# EAGLE schematic Relay_Board_V3.6 (EAGLE 9.6.2)

## Sheet 1 of 2
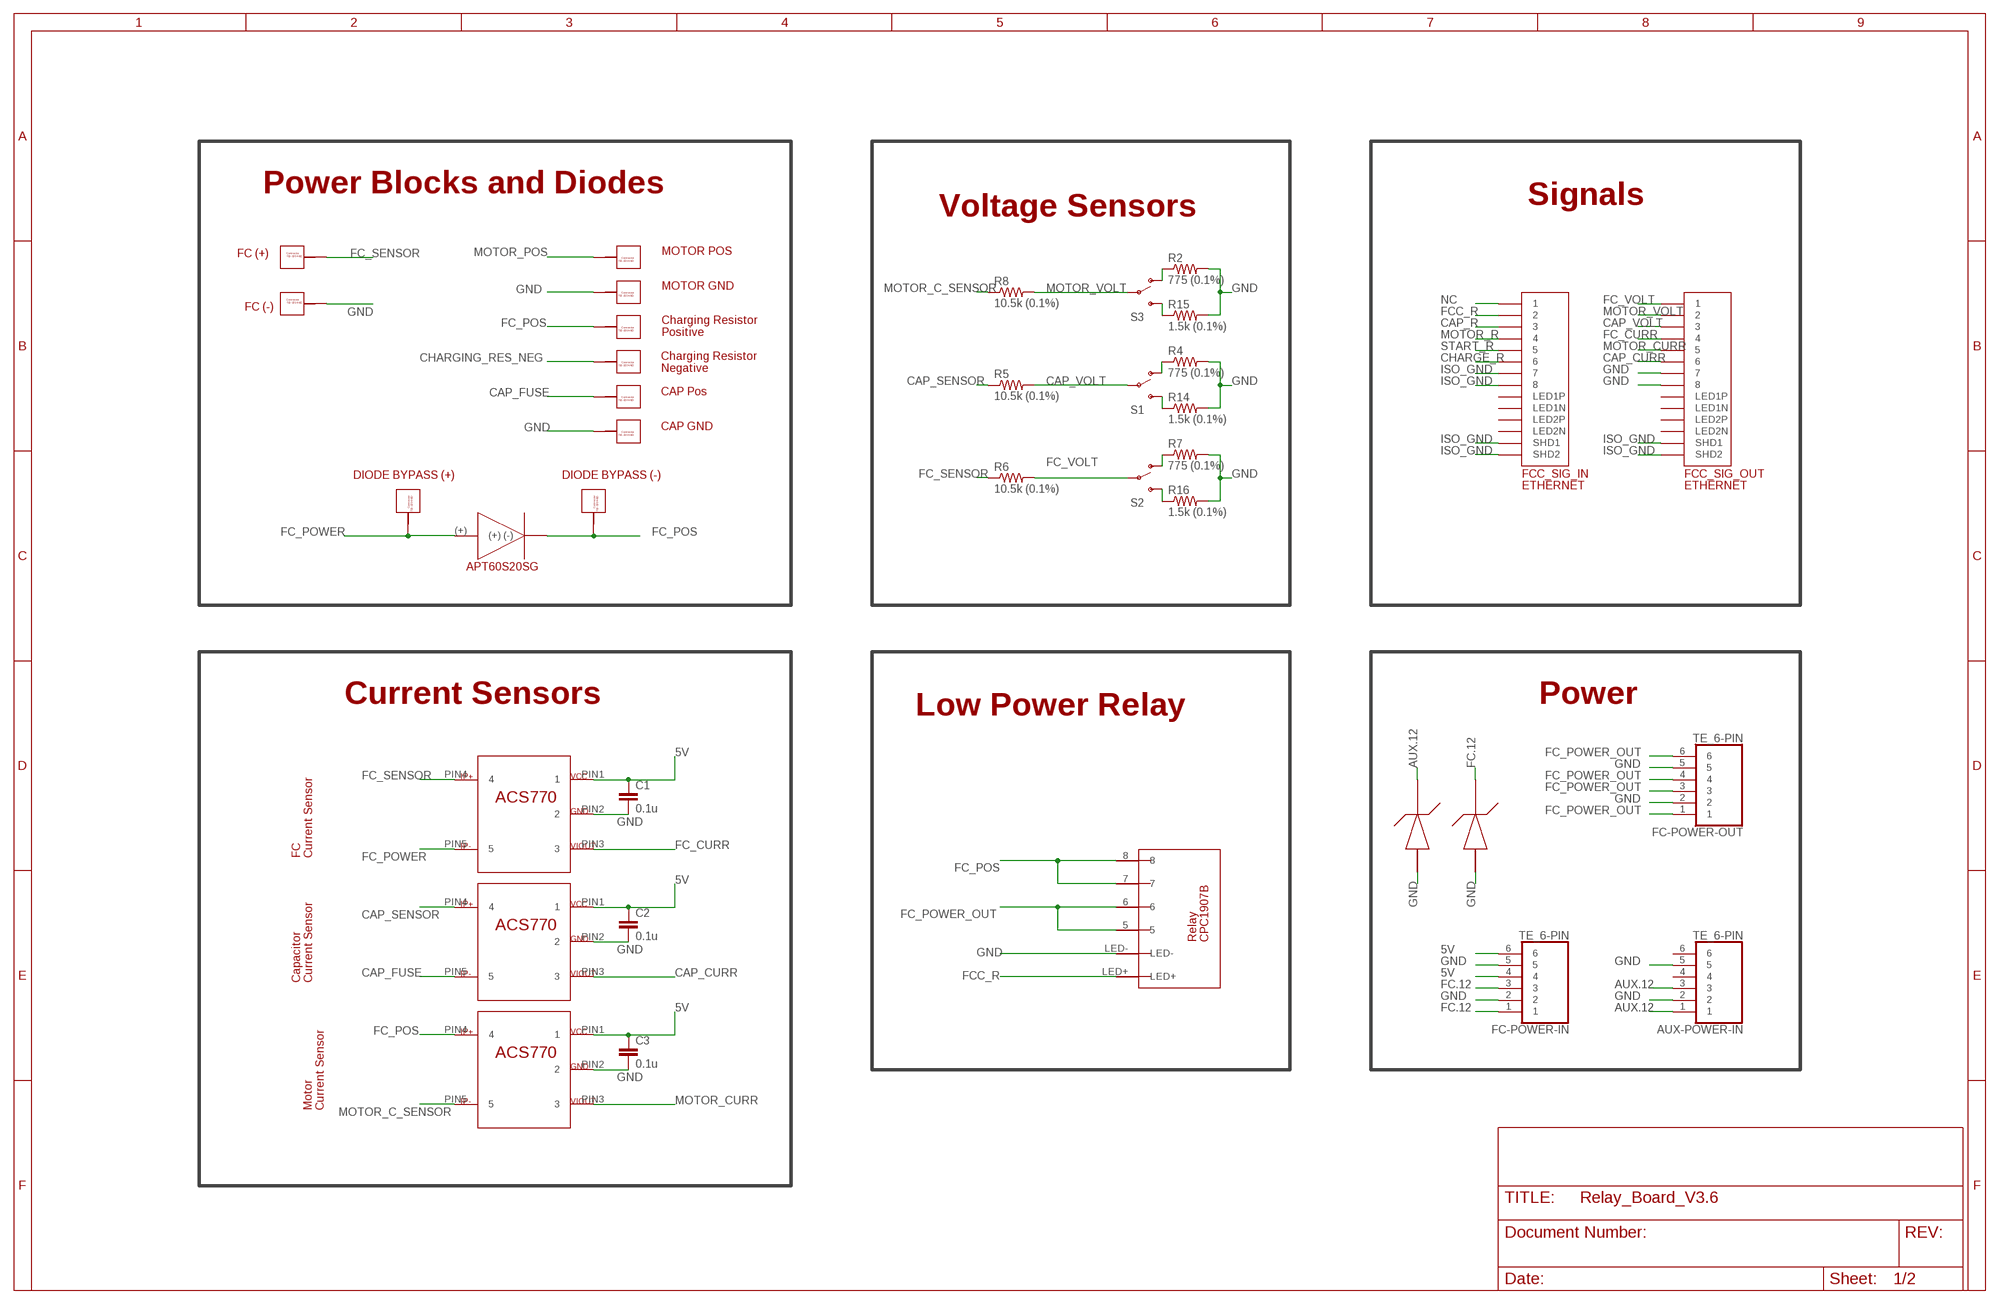
[diagram p0: schematic, sheet 1]

### Parts
AUX-POWER-IN  TE_6-PIN  [TE_6-PIN]
C1  0.1u  CAP0603-CAP  [0603-CAP]
C2  0.1u  CAP0603-CAP  [0603-CAP]
C3  0.1u  CAP0603-CAP  [0603-CAP]
CAP.GND  732-3204-ND_CONNECTOR  [732-3204-ND]
CAP.POS  732-3204-ND_CONNECTOR  [732-3204-ND]
CAP.POS1  732-3204-ND_CONNECTOR  [732-3204-ND]
CAP.POS2  732-3204-ND_CONNECTOR  [732-3204-ND]
D1  APT60S20SG  [TO268]
FC-POWER-IN  TE_6-PIN  [TE_6-PIN]
FC-POWER-OUT  TE_6-PIN  [TE_6-PIN]
FC.GND  732-3204-ND_CONNECTOR  [732-3204-ND]
FC.POS  732-3204-ND_CONNECTOR  [732-3204-ND]
FCC_SIG_IN  ETHERNET  [A122645-ND]
FCC_SIG_OUT  ETHERNET  [A122645-ND]
MOTOR.GROUND  732-3204-ND_CONNECTOR  [732-3204-ND]
MOTOR.POSITIVE  732-3204-ND_CONNECTOR  [732-3204-ND]
R2  775 (0.1%)  R-US_R0805  [R0805]
R4  775 (0.1%)  R-US_R0805  [R0805]
R5  10.5k (0.1%)  R-US_R0805  [R0805]
R6  10.5k (0.1%)  R-US_R0805  [R0805]
R7  775 (0.1%)  R-US_R0805  [R0805]
R8  10.5k (0.1%)  R-US_R0805  [R0805]
R14  1.5k (0.1%)  R-US_R0805  [R0805]
R15  1.5k (0.1%)  R-US_R0805  [R0805]
R16  1.5k (0.1%)  R-US_R0805  [R0805]
RES.NEG  732-3204-ND_CONNECTOR  [732-3204-ND]
RES.POS  732-3204-ND_CONNECTOR  [732-3204-ND]
S1  SWITCH-SPDTPTH  [SWITCH-SPDT]
S2  SWITCH-SPDTPTH  [SWITCH-SPDT]
S3  SWITCH-SPDTPTH  [SWITCH-SPDT]
U$7  ACS770LCB_CURRENTSENSOR  [ACS770LCB_CURRENTSENSOR]
U$8  ACS770LCB_CURRENTSENSOR  [ACS770LCB_CURRENTSENSOR]
U$9  ACS770LCB_CURRENTSENSOR  [ACS770LCB_CURRENTSENSOR]
U$15  P6KE15A-E3/54GICT-ND_TVS_DIODE  [P6KE15A-E3/54GICT-ND_TVS_DIODE]
U$16  P6KE15A-E3/54GICT-ND_TVS_DIODE  [P6KE15A-E3/54GICT-ND_TVS_DIODE]
U$22  RELAY-CPC1907B  [RELAY-CPC1907B]

### Nets
5V: C1.1 C2.1 C3.1 FC-POWER-IN.4 FC-POWER-IN.6 U$7.PIN1 U$8.PIN1 U$9.PIN1
AUX.12: AUX-POWER-IN.1 AUX-POWER-IN.3 U$16.P$2(P(-)) ; also sheet 2
CAP_CURR: FCC_SIG_OUT.P$6 U$8.PIN3
CAP_FUSE: CAP.POS.P$1 CAP.POS.P$2 CAP.POS.P$3 CAP.POS.P$4 CAP.POS.P$5 CAP.POS.P$6 CAP.POS.P$7 CAP.POS.P$8 CAP.POS.P$9 CAP.POS.P$10 U$8.PIN5
CAP_R: FCC_SIG_IN.P$3 ; also sheet 2
CAP_SENSOR: R5.1 U$8.PIN4 ; also sheet 2
CAP_VOLT: FCC_SIG_OUT.P$3 R5.2 S1.2(P)
CHARGE_R: FCC_SIG_IN.P$6 ; also sheet 2
CHARGING_RES_NEG: RES.NEG.P$1 RES.NEG.P$2 RES.NEG.P$3 RES.NEG.P$4 RES.NEG.P$5 RES.NEG.P$6 RES.NEG.P$7 RES.NEG.P$8 RES.NEG.P$9 RES.NEG.P$10 ; also sheet 2
FC.12: FC-POWER-IN.1 FC-POWER-IN.3 U$15.P$2(P(-)) ; also sheet 2
FC_CURR: FCC_SIG_OUT.P$4 U$7.PIN3
FC_POS: CAP.POS2.P$1 CAP.POS2.P$2 CAP.POS2.P$3 CAP.POS2.P$4 CAP.POS2.P$5 CAP.POS2.P$6 CAP.POS2.P$7 CAP.POS2.P$8 CAP.POS2.P$9 CAP.POS2.P$10 D1.(-) D1.C@1((-)) D1.C@2((-)) RES.POS.P$1 RES.POS.P$2 RES.POS.P$3 RES.POS.P$4 RES.POS.P$5 RES.POS.P$6 RES.POS.P$7 RES.POS.P$8 RES.POS.P$9 RES.POS.P$10 U$9.PIN4 U$22.7 U$22.8 ; also sheet 2
FC_POWER: CAP.POS1.P$1 CAP.POS1.P$2 CAP.POS1.P$3 CAP.POS1.P$4 CAP.POS1.P$5 CAP.POS1.P$6 CAP.POS1.P$7 CAP.POS1.P$8 CAP.POS1.P$9 CAP.POS1.P$10 D1.(+) U$7.PIN5
FC_POWER_OUT: FC-POWER-OUT.1 FC-POWER-OUT.3 FC-POWER-OUT.4 FC-POWER-OUT.6 U$22.5 U$22.6
FC_SENSOR: FC.POS.P$1 FC.POS.P$2 FC.POS.P$3 FC.POS.P$4 FC.POS.P$5 FC.POS.P$6 FC.POS.P$7 FC.POS.P$8 FC.POS.P$9 FC.POS.P$10 R6.1 U$7.PIN4
FC_VOLT: FCC_SIG_OUT.P$1 R6.2 S2.2(P)
FCC_R: FCC_SIG_IN.P$2 U$22.LED+
GND: AUX-POWER-IN.2 AUX-POWER-IN.5 C1.2 C2.2 C3.2 CAP.GND.P$1 CAP.GND.P$2 CAP.GND.P$3 CAP.GND.P$4 CAP.GND.P$5 CAP.GND.P$6 CAP.GND.P$7 CAP.GND.P$8 CAP.GND.P$9 CAP.GND.P$10 FC-POWER-IN.2 FC-POWER-IN.5 FC-POWER-OUT.2 FC-POWER-OUT.5 FC.GND.P$1 FC.GND.P$2 FC.GND.P$3 FC.GND.P$4 FC.GND.P$5 FC.GND.P$6 FC.GND.P$7 FC.GND.P$8 FC.GND.P$9 FC.GND.P$10 FCC_SIG_OUT.P$7 FCC_SIG_OUT.P$8 MOTOR.GROUND.P$1 MOTOR.GROUND.P$2 MOTOR.GROUND.P$3 MOTOR.GROUND.P$4 MOTOR.GROUND.P$5 MOTOR.GROUND.P$6 MOTOR.GROUND.P$7 MOTOR.GROUND.P$8 MOTOR.GROUND.P$9 MOTOR.GROUND.P$10 R2.2 R4.2 R7.2 R14.2 R15.2 R16.2 U$7.PIN2 U$8.PIN2 U$9.PIN2 U$15.P$1(P(+)) U$16.P$1(P(+)) U$22.LED- ; also sheet 2
ISO_GND: FCC_SIG_IN.P$7 FCC_SIG_IN.P$8 FCC_SIG_IN.P$13(SHD1) FCC_SIG_IN.P$14(SHD2) FCC_SIG_OUT.P$13(SHD1) FCC_SIG_OUT.P$14(SHD2) ; also sheet 2
MOTOR_C_SENSOR: R8.1 U$9.PIN5 ; also sheet 2
MOTOR_CURR: FCC_SIG_OUT.P$5 U$9.PIN3
MOTOR_POS: MOTOR.POSITIVE.P$1 MOTOR.POSITIVE.P$2 MOTOR.POSITIVE.P$3 MOTOR.POSITIVE.P$4 MOTOR.POSITIVE.P$5 MOTOR.POSITIVE.P$6 MOTOR.POSITIVE.P$7 MOTOR.POSITIVE.P$8 MOTOR.POSITIVE.P$9 MOTOR.POSITIVE.P$10 ; also sheet 2
MOTOR_R: FCC_SIG_IN.P$4 ; also sheet 2
MOTOR_VOLT: FCC_SIG_OUT.P$2 R8.2 S3.2(P)
N$9: R4.1 S1.1(O)
N$10: R14.1 S1.3(S)
N$11: R2.1 S3.1(O)
N$12: R15.1 S3.3(S)
N$16: R7.1 S2.1(O)
N$17: R16.1 S2.3(S)
NC: FCC_SIG_IN.P$1
START_R: FCC_SIG_IN.P$5 ; also sheet 2
Unconnected: AUX-POWER-IN.4 AUX-POWER-IN.6 FCC_SIG_IN.P$9(LED1N) FCC_SIG_IN.P$10(LED1P) FCC_SIG_IN.P$11(LED2N) FCC_SIG_IN.P$12(LED2P) FCC_SIG_OUT.P$9(LED1N) FCC_SIG_OUT.P$10(LED1P) FCC_SIG_OUT.P$11(LED2N) FCC_SIG_OUT.P$12(LED2P)

### Notes on the sheet
- Power Blocks and Diodes
- Signals
- Voltage Sensors
- FC (+) | MOTOR POS
- MOTOR GND
- FC (-)
- Charging Resistor
  Positive
- Charging Resistor
  Negative
- CAP Pos
- CAP GND
- DIODE BYPASS (+) | DIODE BYPASS (-)
- Current Sensors | Power
- Low Power Relay
- FC
  Current Sensor
- Capacitor
  Current Sensor
- Motor
  Current Sensor

## Sheet 2 of 2
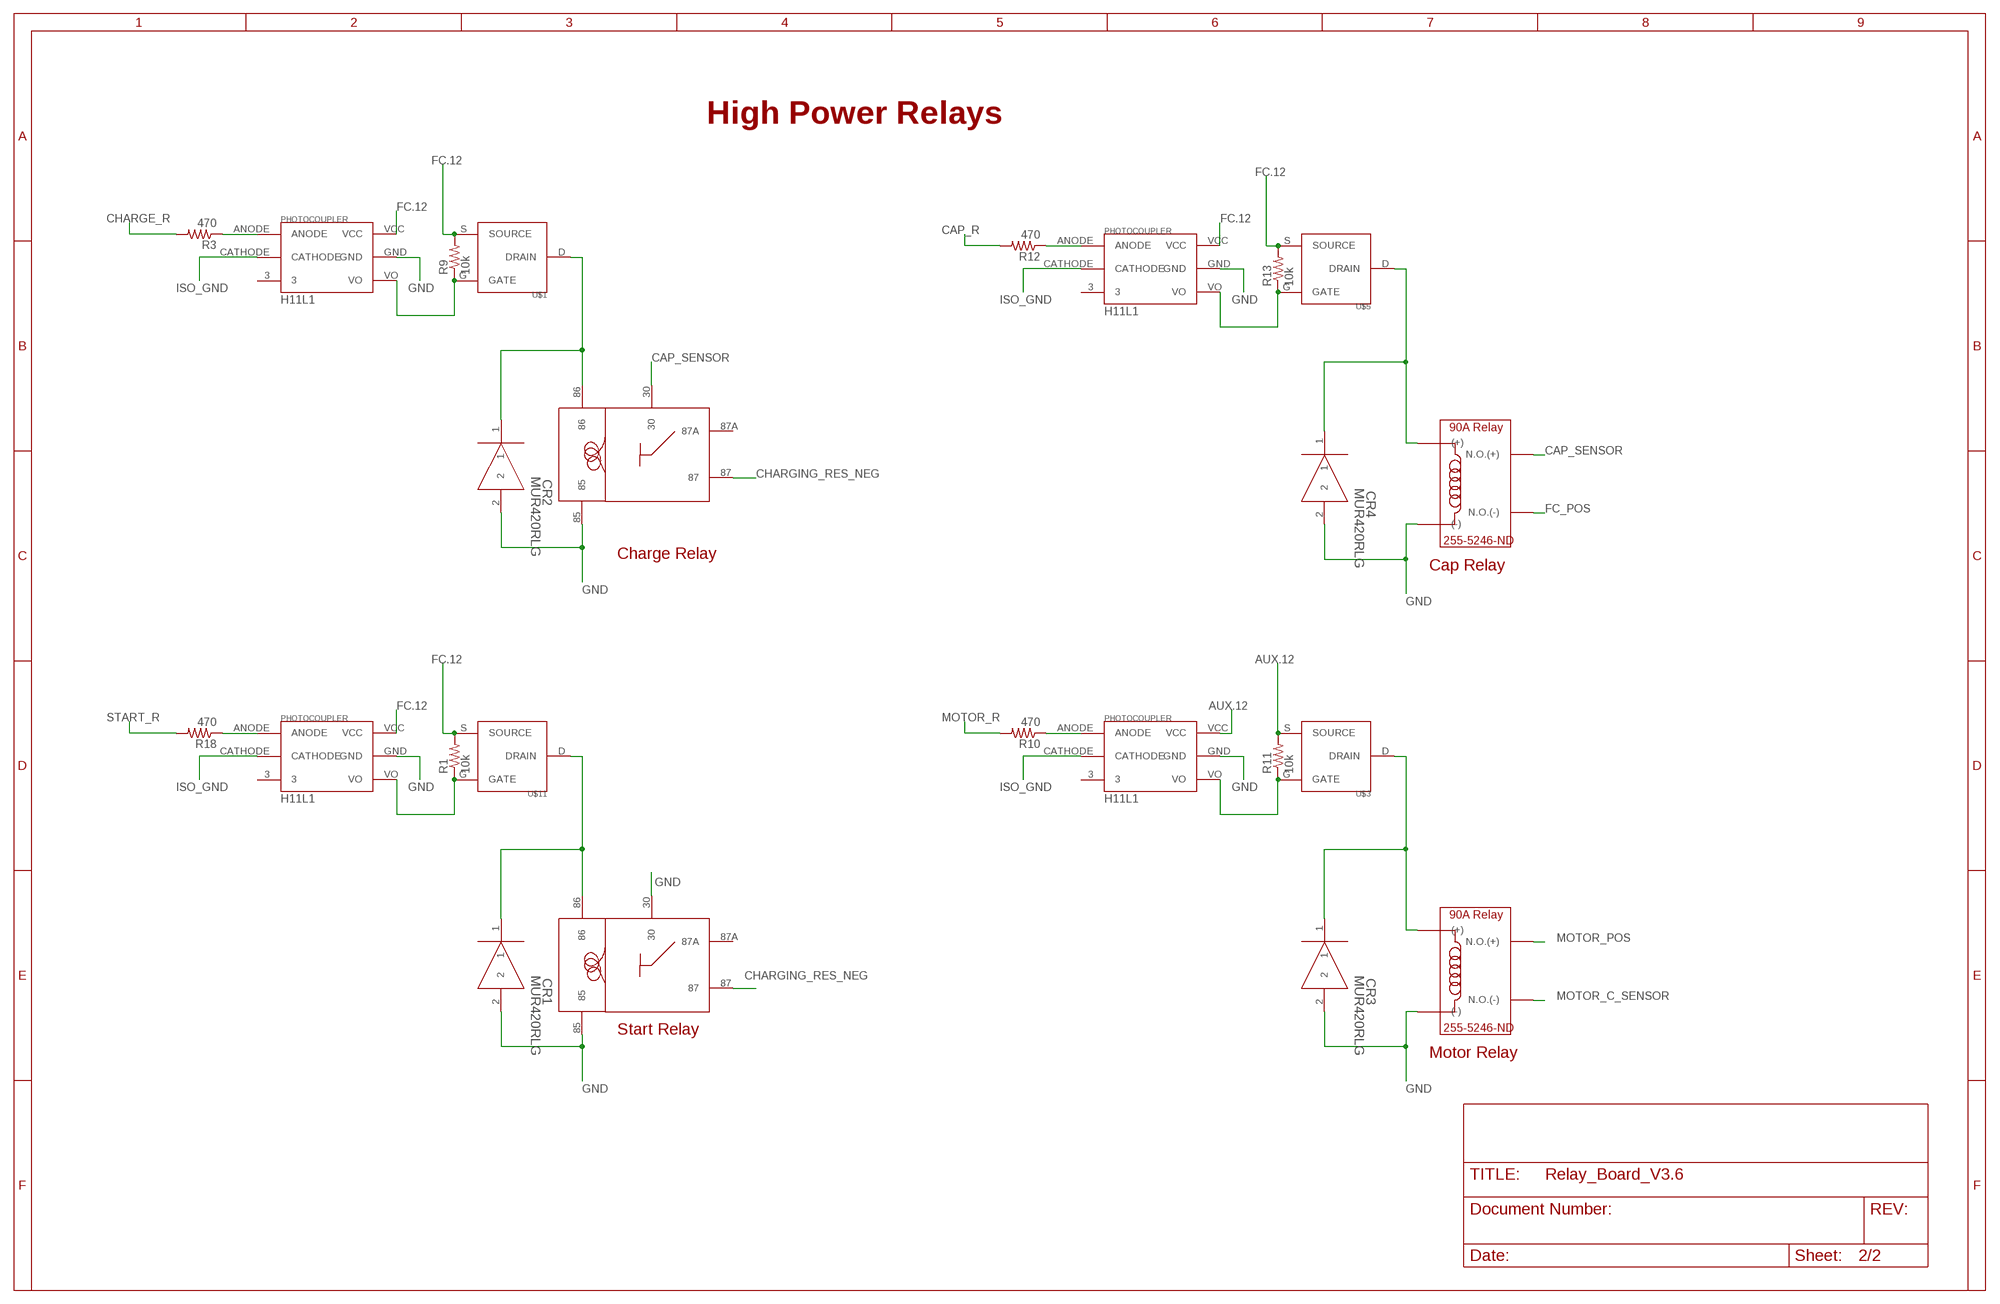
[diagram p1: schematic, sheet 2]

### Parts
CR1  MUR420RLG  [DO-201AD]
CR2  MUR420RLG  [DO-201AD]
CR3  MUR420RLG  [DO-201AD]
CR4  MUR420RLG  [DO-201AD]
R1  10k  RESISTOR0603-RES  [0603-RES]
R3  470  RESISTOR0603-RES  [0603-RES]
R9  10k  RESISTOR0603-RES  [0603-RES]
R10  470  RESISTOR0603-RES  [0603-RES]
R11  10k  RESISTOR0603-RES  [0603-RES]
R12  470  RESISTOR0603-RES  [0603-RES]
R13  10k  RESISTOR0603-RES  [0603-RES]
R18  470  RESISTOR0603-RES  [0603-RES]
START.RELAY1  VCF4-1000  [VCF4-1000]
START.RELAY2  VCF4-1000  [VCF4-1000]
U$1  DMP3056L-7DMP3056L-7  [DMP3056L-7]
U$2  H11L1H11L1  [H11L1]
U$3  DMP3056L-7DMP3056L-7  [DMP3056L-7]
U$4  H11L1H11L1  [H11L1]
U$5  DMP3056L-7DMP3056L-7  [DMP3056L-7]
U$6  H11L1H11L1  [H11L1]
U$11  DMP3056L-7DMP3056L-7  [DMP3056L-7]
U$12  H11L1H11L1  [H11L1]
U$13  255-5246-ND  [255-5246-ND]
U$14  255-5246-ND  [255-5246-ND]

### Nets
AUX.12: R11.2 U$3.S(SOURCE) U$4.VCC ; also sheet 1
CAP_R: R12.2 ; also sheet 1
CAP_SENSOR: START.RELAY2.30 U$13.NO(+)(N.O.(+)) U$13.NO(++)(N.O.(+)) ; also sheet 1
CHARGE_R: R3.2 ; also sheet 1
CHARGING_RES_NEG: START.RELAY1.87 START.RELAY2.87 ; also sheet 1
FC.12: R1.2 R9.2 R13.2 U$1.S(SOURCE) U$2.VCC U$5.S(SOURCE) U$6.VCC U$11.S(SOURCE) U$12.VCC ; also sheet 1
FC_POS: U$13.NO(-)(N.O.(-)) U$13.NO(--)(N.O.(-)) ; also sheet 1
GND: CR1.2 CR2.2 CR3.2 CR4.2 START.RELAY1.30 START.RELAY1.85 START.RELAY2.85 U$2.GND U$4.GND U$6.GND U$12.GND U$13.(-) U$13.(--)((-)) U$14.(-) U$14.(--)((-)) ; also sheet 1
ISO_GND: U$2.CATHODE U$4.CATHODE U$6.CATHODE U$12.CATHODE ; also sheet 1
MOTOR_C_SENSOR: U$14.NO(-)(N.O.(-)) U$14.NO(--)(N.O.(-)) ; also sheet 1
MOTOR_POS: U$14.NO(+)(N.O.(+)) U$14.NO(++)(N.O.(+)) ; also sheet 1
MOTOR_R: R10.2 ; also sheet 1
N$1: R9.1 U$1.G(GATE) U$2.VO
N$2: R3.1 U$2.ANODE
N$3: CR2.1 START.RELAY2.86 U$1.D(DRAIN)
N$4: R11.1 U$3.G(GATE) U$4.VO
N$5: R10.1 U$4.ANODE
N$6: CR3.1 U$3.D(DRAIN) U$14.(+) U$14.(++)((+))
N$7: R13.1 U$5.G(GATE) U$6.VO
N$8: R12.1 U$6.ANODE
N$13: CR4.1 U$5.D(DRAIN) U$13.(+) U$13.(++)((+))
N$21: R1.1 U$11.G(GATE) U$12.VO
N$23: R18.1 U$12.ANODE
N$30: CR1.1 START.RELAY1.86 U$11.D(DRAIN)
START_R: R18.2 ; also sheet 1
Unconnected: START.RELAY1.87A START.RELAY2.87A U$2.3 U$4.3 U$6.3 U$12.3

### Notes on the sheet
- High Power Relays
- Charge Relay
- Cap Relay
- Start Relay
- Motor Relay

## Library data of the parts
AUX-POWER-IN FC-POWER-IN FC-POWER-OUT = EcoCar-Connectors:TE_6-PIN: 6 Pin TE Mini-Universal MATE-N-LOK Part Number: 1-770969-0 Digikey Part Number: A32475-ND Matching Plug: A97674-ND Matching Crimps: A100828CT-ND
C1-C3 = SparkFun-Passives:CAP: Capacitor Standard 0603 ceramic capacitor, and 0.1" leaded capacitor.
CAP.GND CAP.POS CAP.POS1 CAP.POS2 FC.GND FC.POS MOTOR.GROUND MOTOR.POSITIVE RES.NEG RES.POS = Connector 732-3204:732-3204-ND_CONNECTOR
CR1-CR4 = MUR420RLG - Diode:MUR420RLG; MANUFACTURER_PART_NUMBER: MUR420RLG; VENDOR: ON Semiconductor
D1 = Diode - APT60S20SG:APT60S20SG
FCC_SIG_IN FCC_SIG_OUT = ETHERNET-3:ETHERNET: Ethernet port with 2 leds. digikey number A122645-ND
R1 R3 R9-R13 R18 = SparkFun:RESISTOR: Resistor Basic schematic elements and footprints for 0603, 1206, and PTH resistors.
R2 R4-R8 R14-R16 = Resistor:R-US_: RESISTOR, American symbol
S1-S3 = SparkFun-Electromechanical:SWITCH-SPDT: SPDT Switch Simple slide switch, Spark Fun Electronics SKU : COM-00102 DPDT SMT slide switch, AYZ0202, SWCH-08179; PROD_ID: SWCH-08261
START.RELAY1 START.RELAY2 = VCF4-1000:VCF4-1000: Part for the VCF4-1000 relay socket. Digi-Key Part Number: PB232-ND. Pin numbering is directly taken from the data sheet of the relay. Relay Digi-Key Part Number: 255-2083-ND (Also works with 255-1825-ND). If using relay 255-1825-ND, ignore pin 87A.
U$1 U$3 U$5 U$11 = DMP3056L-7:DMP3056L-7
U$2 U$4 U$6 U$12 = FCC_parts:H11L1
U$7-U$9 = ACS770 Current Sensor:ACS770LCB_CURRENTSENSOR
U$13 U$14 = Relay 255-5246-ND:255-5246-ND
U$15 U$16 = TVS Diode Through-Hole:P6KE15A-E3/54GICT-ND_TVS_DIODE
U$22 = Relay_CPC1907B:RELAY-CPC1907B